# Altium schematic sheet EDU_High-Speed-Design_CPU_MMC-Card.SchDoc: CPU MMC-Card
size 279 x 215 mm; Date: not used; ApprovedBy: not used; CheckedBy: not used; Author: not used; DrawnBy: not used; Organization: not used; Address4: not used; SheetNumber: 15; SheetTotal: 26; Time: not used; ImagePath: not used; Application_BuildNumber: not used
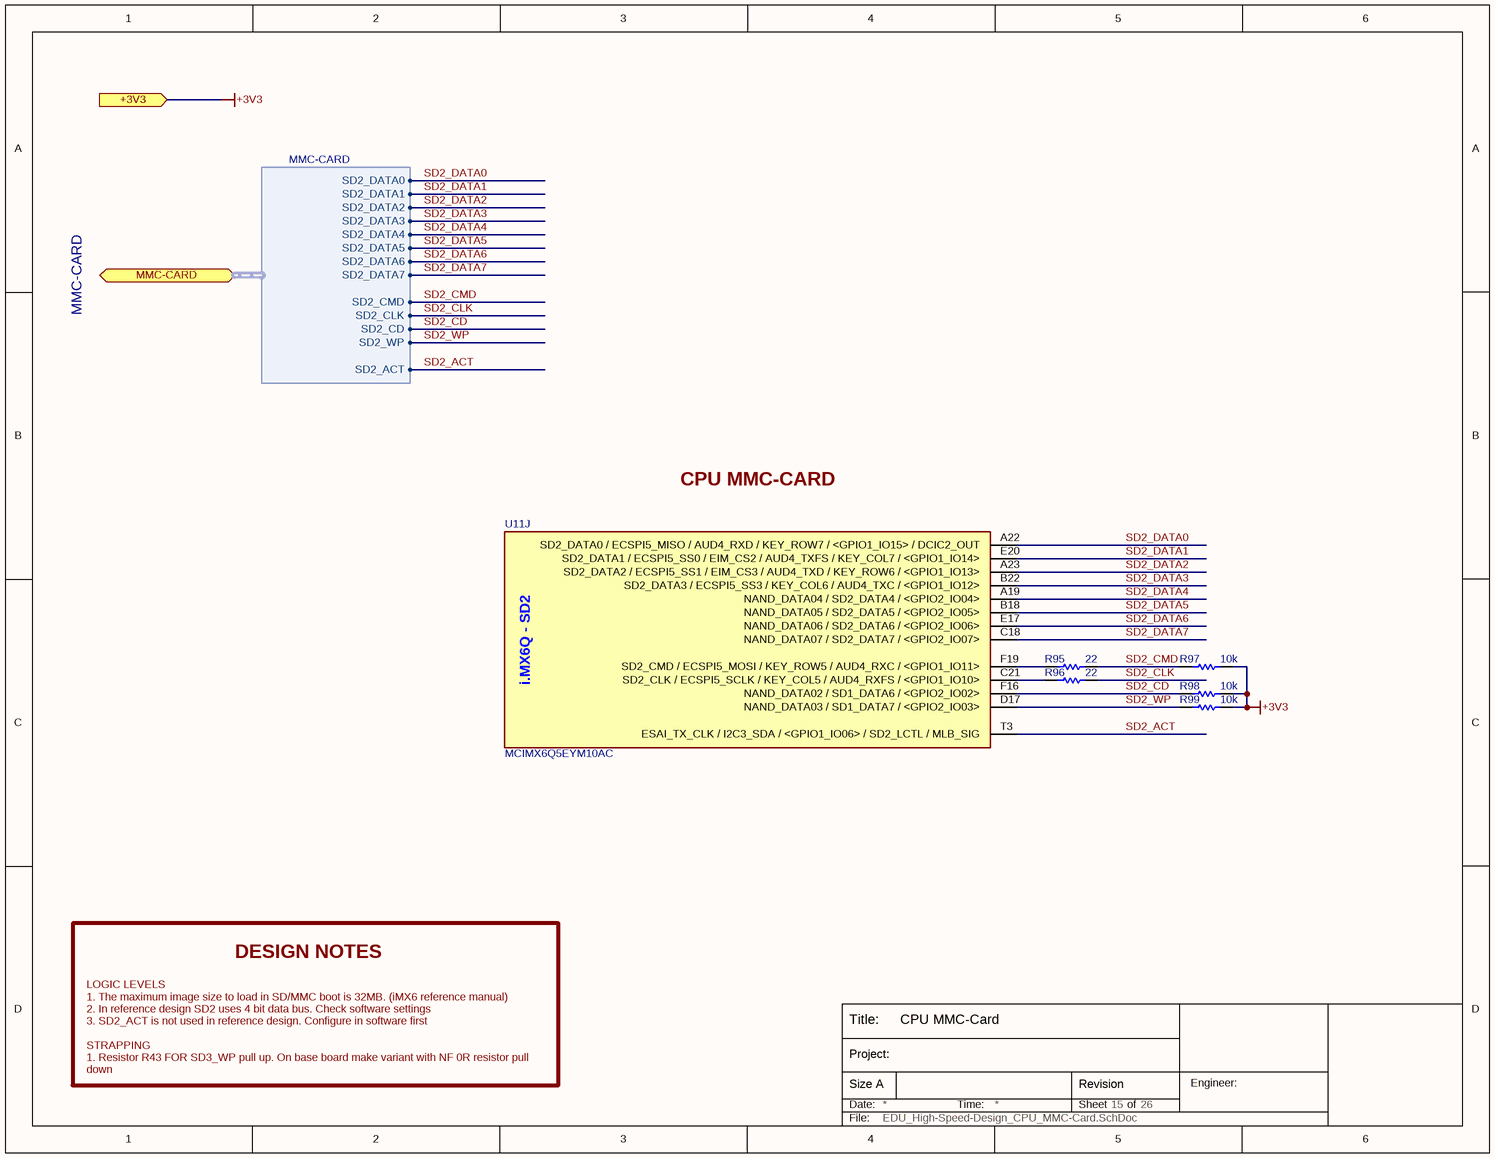
[diagram p0: EDU_High-Speed-Design_CPU_MMC-Card.SchDoc]

## Parts
R95  22  [R0402]
R96  22  [R0402]
R97  10k  [R0402]
R98  10k  [R0402]
R99  10k  [R0402]
U11  MCIMX6Q5EYM10AC  [MCIMX6Q5EYM10AC]  (part J of 15)

## Ports
+3V3 (in), MMC-CARD (bidir, harness MMC-CARD)

## Harnesses
MMC-CARD: SD2_DATA0, SD2_CLK, SD2_CD, SD2_WP, SD2_CMD, SD2_DATA1, SD2_DATA2, SD2_DATA3, SD2_DATA4, SD2_DATA5, SD2_DATA6, SD2_DATA7, SD2_ACT

## Nets
+3V3: R97.2 R98.2 R99.2 ; port +3V3
SD2_ACT: U11.T3(ESAI_TX_CLK_/_I2C3_SDA_/_<GPIO1_IO06>_/_SD2_LCTL_/_MLB_SIG) ; port MMC-CARD.SD2_ACT
SD2_CD: R98.1 U11.F16(NAND_DATA02_/_SD1_DATA6_/_<GPIO2_IO02>) ; port MMC-CARD.SD2_CD
SD2_CLK: R96.1 ; port MMC-CARD.SD2_CLK
SD2_CMD: R95.1 R97.1 ; port MMC-CARD.SD2_CMD
SD2_DATA0: U11.A22(SD2_DATA0_/_ECSPI5_MISO_/_AUD4_RXD_/_KEY_ROW7_/_<GPIO1_IO15>_/_DCIC2_OUT) ; port MMC-CARD.SD2_DATA0
SD2_DATA1: U11.E20(SD2_DATA1_/_ECSPI5_SS0_/_EIM_CS2_/_AUD4_TXFS_/_KEY_COL7_/_<GPIO1_IO14>) ; port MMC-CARD.SD2_DATA1
SD2_DATA2: U11.A23(SD2_DATA2_/_ECSPI5_SS1_/_EIM_CS3_/_AUD4_TXD_/_KEY_ROW6_/_<GPIO1_IO13>) ; port MMC-CARD.SD2_DATA2
SD2_DATA3: U11.B22(SD2_DATA3_/_ECSPI5_SS3_/_KEY_COL6_/_AUD4_TXC_/_<GPIO1_IO12>) ; port MMC-CARD.SD2_DATA3
SD2_DATA4: U11.A19(NAND_DATA04_/_SD2_DATA4_/_<GPIO2_IO04>) ; port MMC-CARD.SD2_DATA4
SD2_DATA5: U11.B18(NAND_DATA05_/_SD2_DATA5_/_<GPIO2_IO05>) ; port MMC-CARD.SD2_DATA5
SD2_DATA6: U11.E17(NAND_DATA06_/_SD2_DATA6_/_<GPIO2_IO06>) ; port MMC-CARD.SD2_DATA6
SD2_DATA7: U11.C18(NAND_DATA07_/_SD2_DATA7_/_<GPIO2_IO07>) ; port MMC-CARD.SD2_DATA7
SD2_WP: R99.1 U11.D17(NAND_DATA03_/_SD1_DATA7_/_<GPIO2_IO03>) ; port MMC-CARD.SD2_WP
NetR95_2: R95.2 U11.F19(SD2_CMD_/_ECSPI5_MOSI_/_KEY_ROW5_/_AUD4_RXC_/_<GPIO1_IO11>)
NetR96_2: R96.2 U11.C21(SD2_CLK_/_ECSPI5_SCLK_/_KEY_COL5_/_AUD4_RXFS_/_<GPIO1_IO10>)

## Notes on the sheet
- MMC-CARD
- CPU MMC-CARD
- DESIGN NOTES
- LOGIC LEVELS
  1. The maximum image size to load in SD/MMC boot is 32MB. (iMX6 reference manual)
  2. In reference design SD2 uses 4 bit data bus. Check software settings
  3. SD2_ACT is not used in reference design. Configure in software first
  STRAPPING
  1. Resistor R43 FOR SD3_WP pull up. On base board make variant with NF 0R resistor pull down
- Title:
- Date:
- Size A
- Project:
- Time:
- Sheet
- Revision
- of
- Engineer:
- File:
- (in symbol MCIMX6Q5EYM10AC, part J) i.MX6Q - SD2

## Library data of the parts
R95 R96 = RC0402FR-0722RL: RES 22.0 OHM 1/16W 1% 0402 SMD; Manufacturer 1: Yageo; Manufacturer Part Number 1: RC0402FR-0722RL; Resistance: 22; Supplier 1: Digi-Key; Supplier Part Number 1: 311-22.0LRCT-ND; ComponentLink1URL: http://www.yageo.com/documents/recent/PYu-RC0402_51_RoHS_L_6.pdf; ComponentLink1Description: http://www.yageo.com/documents/recent/PYu-RC0402_51_RoHS_L_6.pdf
R97-R99 = RC0402FR-0710KL: RES 10.0K OHM 1/16W 1% 0402 SMD; Manufacturer 1: Yageo; Manufacturer Part Number 1: RC0402FR-0710KL; Resistance: 10k; Supplier 1: Digi-Key; Supplier Part Number 1: 311-10.0KLRCT-ND; ComponentLink1URL: http://www.yageo.com/documents/recent/PYu-RC0402_51_RoHS_L_6.pdf; ComponentLink1Description: http://www.yageo.com/documents/recent/PYu-RC0402_51_RoHS_L_6.pdf
U11 = MCIMX6Q5EYM10AC: IC MCU 32BIT ARM QUAD 624FCBGA; Manufacturer 1: Freescale Semiconductor; Supplier 1: Digi-Key; Manufacturer Part Number 1: MCIMX6Q5EYM10AC; Supplier Part Number 1: MCIMX6Q5EYM10AC-ND